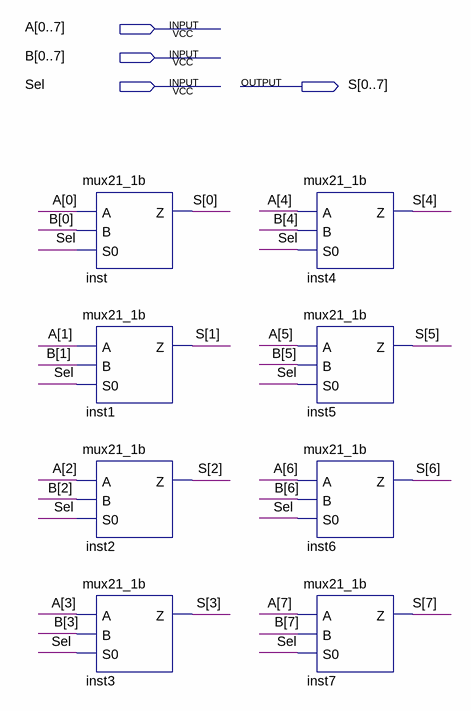
[diagram p0: schematic sheet]
// Quartus schematic mux21_8b.bdf as structural Verilog: 8 symbols, 4 pins
module mux21_8b (
  input  [0:7] A,
  input  [0:7] B,
  input  Sel,
  output [0:7] S
);

  mux21_1b inst (.A(A[0]), .B(B[0]), .S0(Sel), .Z(S[0]));
  mux21_1b inst1 (.A(A[1]), .B(B[1]), .S0(Sel), .Z(S[1]));
  mux21_1b inst2 (.A(A[2]), .B(B[2]), .S0(Sel), .Z(S[2]));
  mux21_1b inst3 (.A(A[3]), .B(B[3]), .S0(Sel), .Z(S[3]));
  mux21_1b inst4 (.A(A[4]), .B(B[4]), .S0(Sel), .Z(S[4]));
  mux21_1b inst5 (.A(A[5]), .B(B[5]), .S0(Sel), .Z(S[5]));
  mux21_1b inst6 (.A(A[6]), .B(B[6]), .S0(Sel), .Z(S[6]));
  mux21_1b inst7 (.A(A[7]), .B(B[7]), .S0(Sel), .Z(S[7]));
endmodule
